# Altium schematic sheet Block Diagram.SchDoc: Block Diagram
size 292 x 193 mm; SheetNumber: 1; SheetTotal: 4
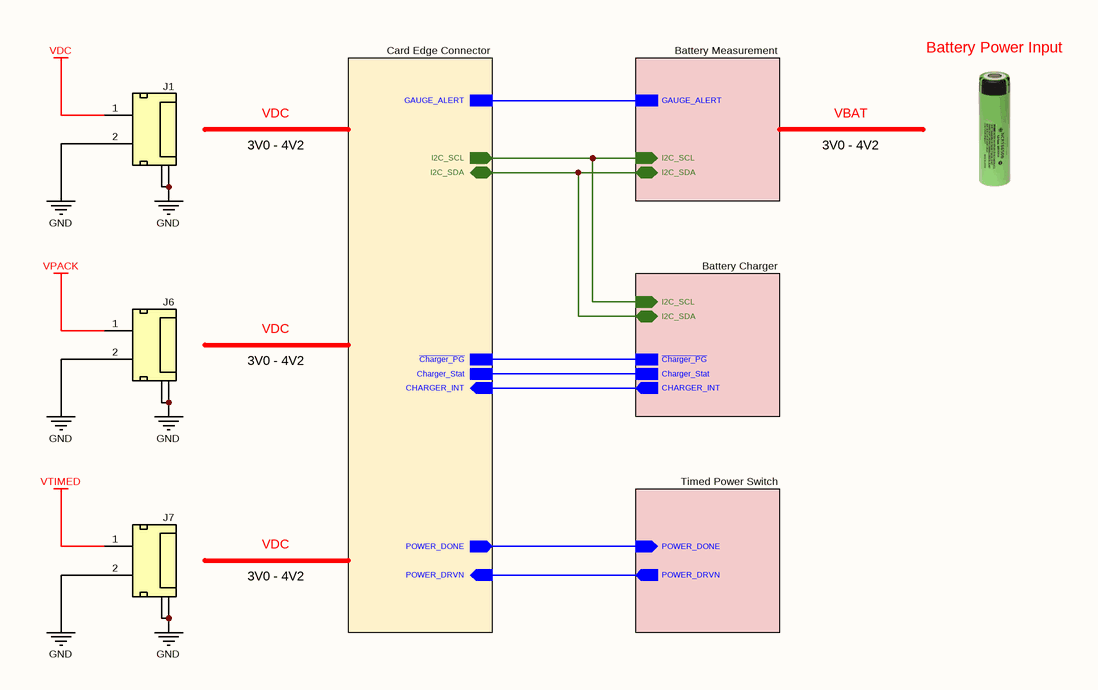
[diagram p0: Block Diagram.SchDoc]

## Parts
J1  2P SMD Tunic Connector  [Connector_Tunic 2P]  (value not drawn)
J6  2P SMD Tunic Connector  [Connector_Tunic 2P]  (value not drawn)
J7  2P SMD Tunic Connector  [Connector_Tunic 2P]  (value not drawn)

## Sub-sheets
Battery Charger = Battery Charger.SchDoc: ~{Charger_PG}, Charger_Stat, I2C_SDA (bidir), I2C_SCL (in), CHARGER_INT (out)
Battery Measurement = Battery Measurement.SchDoc: GAUGE_ALERT, I2C_SDA (bidir), I2C_SCL (in)
Card Edge Connector = Card Edge Connector.SchDoc: POWER_DONE (out), POWER_DRVN (in), Charger_Stat, ~{Charger_PG}, CHARGER_INT (in), I2C_SDA (bidir), GAUGE_ALERT, I2C_SCL (out)
Timed Power Switch = Timed Power Switch.SchDoc: POWER_DONE (in), POWER_DRVN (out)

## Nets
GND: J1.2(Pin2) J1.3(GND) J1.4(GND) J6.2(Pin2) J6.3(GND) J6.4(GND) J7.2(Pin2) J7.3(GND) J7.4(GND)
VDC: J1.1(Pin1)
VPACK: J6.1(Pin1)
VTIMED: J7.1(Pin1)
(unnamed): sheet Battery Measurement/GAUGE_ALERT, sheet Card Edge Connector/GAUGE_ALERT
(unnamed): sheet Battery Measurement/I2C_SDA, sheet Battery Charger/I2C_SDA, sheet Card Edge Connector/I2C_SDA
(unnamed): sheet Battery Measurement/I2C_SCL, sheet Battery Charger/I2C_SCL, sheet Card Edge Connector/I2C_SCL
(unnamed): sheet Battery Charger/~{Charger_PG}, sheet Card Edge Connector/~{Charger_PG}
(unnamed): sheet Battery Charger/Charger_Stat, sheet Card Edge Connector/Charger_Stat
(unnamed): sheet Battery Charger/CHARGER_INT, sheet Card Edge Connector/CHARGER_INT
(unnamed): sheet Timed Power Switch/POWER_DONE, sheet Card Edge Connector/POWER_DONE
(unnamed): sheet Timed Power Switch/POWER_DRVN, sheet Card Edge Connector/POWER_DRVN

## Notes on the sheet
- Battery Power Input
- VDC
- 3V0 - 4V2
- VBAT
- © 2021 All rights reserved.
  This document may not, in whole or in part, be copied, photocopied, reproduced, translated or converted to any electronic or machine readable from without prior written permission of Mehmet Günce Akkoyun.
  Engineer contact : akkoyun@me.com
- Property of
- Engineer :
- Date :
- Size :
- A4
- Time :
- Project :
- Page :
- /
- Customer :
- Product ID :
- Module ID :
- Version :
- File :
- Revision :

## Library data of the parts
J1 J6 J7 = Connector - Mini Tunic 2P (1.25): Mini Tunic Connector with 2P; Manufacturer Name: Molex; Manufacturer Part Number: 53261-0271; Height: 3.55mm; Mouser Part Number: 538-53261-0271; ROHS: Yes